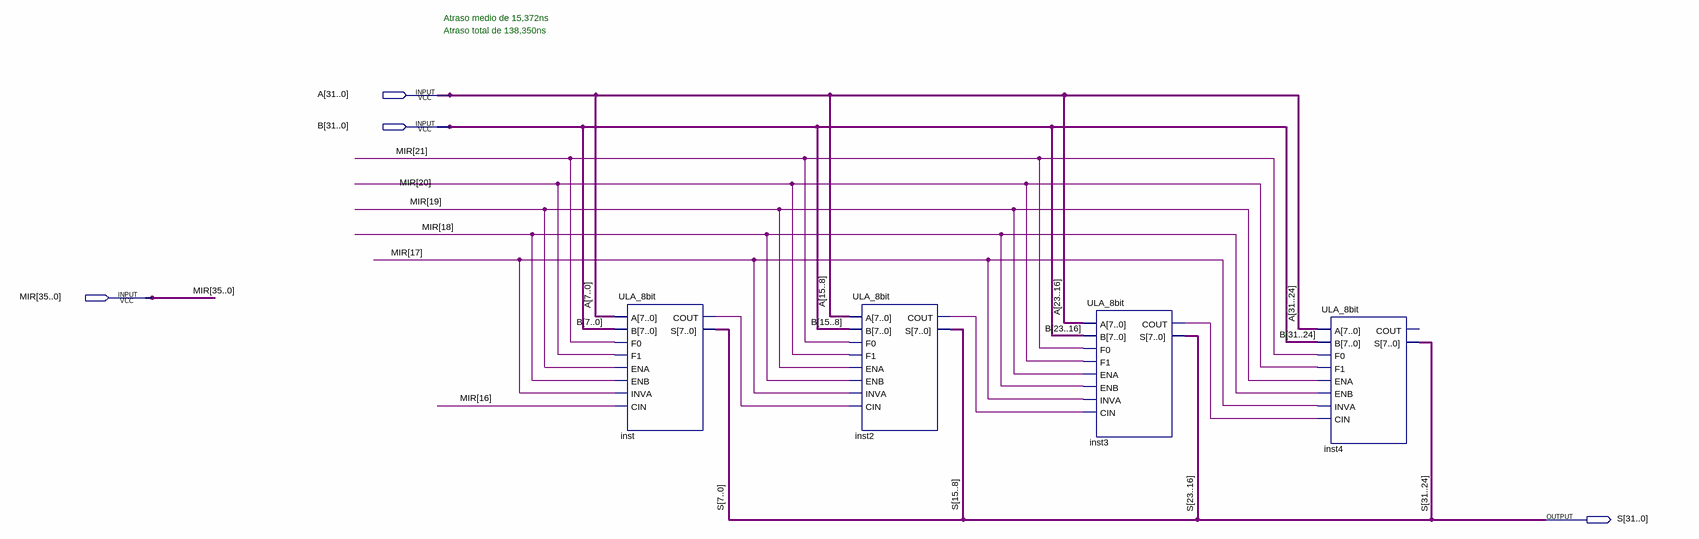
[diagram p0: schematic sheet]
// Quartus schematic ULA_32bit.bdf as structural Verilog: 4 symbols, 4 pins
module ULA_32bit (
  input  [31:0] A,
  input  [31:0] B,
  input  [35:0] MIR,
  output [31:0] S
);

  wire inst2_cout, inst3_cout, inst_cout;

  ULA_8bit inst (
    .A(A[7:0]), .B(B[7:0]), .F0(MIR[21]), .F1(MIR[20]), .ENA(MIR[19]), .ENB(MIR[18]), .INVA(MIR[17]),
    .CIN(MIR[16]), .COUT(inst_cout), .S(S[7:0]));
  ULA_8bit inst2 (
    .A(A[15:8]), .B(B[15:8]), .F0(MIR[21]), .F1(MIR[20]), .ENA(MIR[19]), .ENB(MIR[18]), .INVA(MIR[17]),
    .CIN(inst_cout), .COUT(inst2_cout), .S(S[15:8]));
  ULA_8bit inst3 (
    .A(A[23:16]), .B(B[23:16]), .F0(MIR[21]), .F1(MIR[20]), .ENA(MIR[19]), .ENB(MIR[18]), .INVA(MIR[17]),
    .CIN(inst2_cout), .COUT(inst3_cout), .S(S[23:16]));
  ULA_8bit inst4 (
    .A(A[31:24]), .B(B[31:24]), .F0(MIR[21]), .F1(MIR[20]), .ENA(MIR[19]), .ENB(MIR[18]), .INVA(MIR[17]),
    .CIN(inst3_cout), .S(S[31:24]));  // open: COUT

  // Notes on the sheet:
  //   Atraso medio de 15,372ns
  //   Atraso total de 138,350ns
endmodule
